# EAGLE design Backlight (EAGLE 7.2.0)
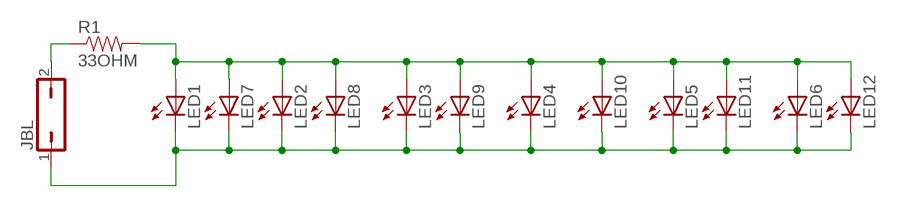
[diagram p0: schematic, sheet 1]

## Parts
JBL  JP1Q  [JP1]
LED1  LEDCHIP-LED0603  [CHIP-LED0603]
LED2  LEDCHIP-LED0603  [CHIP-LED0603]
LED3  LEDCHIP-LED0603  [CHIP-LED0603]
LED4  LEDCHIP-LED0603  [CHIP-LED0603]
LED5  LEDCHIP-LED0603  [CHIP-LED0603]
LED6  LEDCHIP-LED0603  [CHIP-LED0603]
LED7  LEDCHIP-LED0603  [CHIP-LED0603]
LED8  LEDCHIP-LED0603  [CHIP-LED0603]
LED9  LEDCHIP-LED0603  [CHIP-LED0603]
LED10  LEDCHIP-LED0603  [CHIP-LED0603]
LED11  LEDCHIP-LED0603  [CHIP-LED0603]
LED12  LEDCHIP-LED0603  [CHIP-LED0603]
R1  33OHM  33OHM1/10W1%(0603)  [0603]

## Nets
N$1: LED1.A LED2.A LED3.A LED4.A LED5.A LED6.A LED7.A LED8.A LED9.A LED10.A LED11.A LED12.A R1.2
N$2: JBL.1 LED1.C LED2.C LED3.C LED4.C LED5.C LED6.C LED7.C LED8.C LED9.C LED10.C LED11.C LED12.C
N$3: JBL.2 R1.1

## Library data of the parts
JBL = jumper:JP1Q: JUMPER
LED1-LED12 = adafruit:LED: LED OSRAM: - CHIPLED LG R971, LG N971, LY N971, LG Q971, LY Q971, LO R971, LY R971 LH N974, LH R974 LS Q976, LO Q976, LY Q976 LO Q996 - Hyper CHIPLED LW Q18S LB Q993, LB Q99A, LB R99A - SideLED LS A670, LO A670, LY A670, LG A670, LP A670 LB A673, LV A673, LT A673, LW A673 LH A674 LY A675 LS A676, LA A676, LO A676, LY A676, LW A676 LS A679, LY A679, LG A679 - Hyper Micro SIDELED® LS Y876, LA Y876, LO Y876, LY Y876 LT Y87S - SmartLED LW L88C, LW L88S LB L89C, LB L89S, LG L890 LS L89K, LO L89K, LY L89K LS L896, LA L896, LO L896, LY L896 - TOPLED LS T670, LO T670, LY T670, LG T670, LP T670 LSG T670, LSP T670, LSY T670, LOP T670, LYG T670 LG T671, LOG T671, LSG T671 LB T673, LV T673, LT T673, LW T673 LH T674 LS T676, LA T676, LO T676, LY T676, LB T676, LH T676, LSB T676, LW T676 LB T67C, LV T67C, LT T67C, LS T67K, LO T67K, LY T67K, LW E67C LS E67B, LA E67B, LO E67B, LY E67B, LB E67C, LV E67C, LT E67C LW T67C LS T679, LY T679, LG T679 LS T770, LO T770, LY T770, LG T770, LP T770 LB T773, LV T773, LT T773, LW T773 LH T774 LS E675, LA E675, LY E675, LS T675 LS T776, LA T776, LO T776, LY T776, LB T776 LHGB T686 LT T68C, LB T68C - Hyper Mini TOPLED® LB M676 - Mini TOPLED Santana® LG M470 LS M47K, LO M47K, LY M47K Source: http://www.osram.convergy.de/
R1 = SparkFun-Resistors:33OHM1/10W1%(0603): RES-08270; PROD_ID: RES-08270

## Board
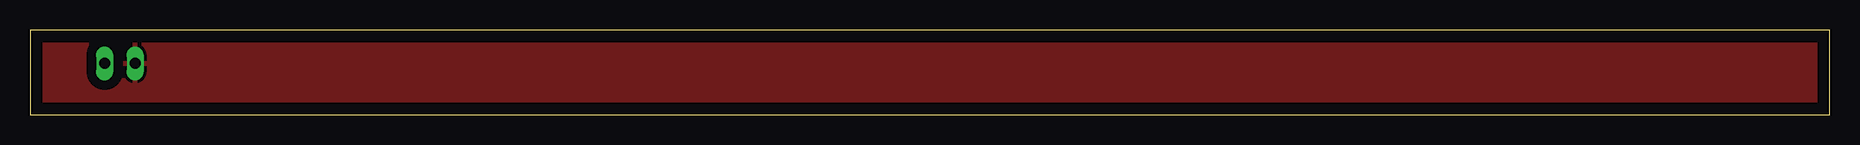
[diagram p1: board, top side]
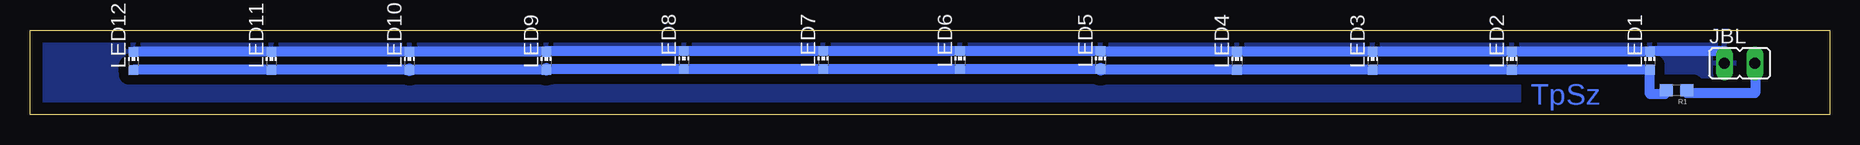
[diagram p2: board, bottom side, seen from below]

Size 150 x 7.05 mm. Coordinates in mm from the lower left corner, seen from the top.
Outline: 0,0 150,0 150,7.05 0,7.05 0,0
Copper layers (1*16): Top 0.035mm / dielectric 1.5mm / Bottom 0.035mm
Design rules "default": minimum track width 10mil, minimum drill 24mil, track to track 8mil, track to pad 8mil, pad to pad 8mil, via to via 8mil, smd to smd 8mil, copper to edge 40mil, drill to drill 8mil, minimum pad ring 10mil, minimum via ring 8mil, stop-mask expansion 4mil, vias tented up to drill 0mil, thermal gap 10mil

### Footprints (pad centres in the part's own frame; a part is rotated, then mirrored left to right if it is on the bottom)
JP1 = drill 0.914 long: 1 0,-1.27; 2 0,1.27
CHIP-LED0603 = smd 0.8 x 0.8: A 0,-0.75; C 0,0.75
0603 = smd 1.1 x 1: 1 -0.85,0; 2 0.85,0

### Placement (x,y rotation side)
JBL  7.49,4.27 270 bottom
LED1  14.97,4.49 0 bottom
LED2  26.48,4.49 0 bottom
LED3  38.09,4.49 0 bottom
LED4  49.4,4.49 0 bottom
LED5  60.77,4.54 0 bottom
LED6  72.48,4.54 0 bottom
LED7  83.89,4.54 0 bottom
LED8  95.5,4.54 0 bottom
LED9  106.97,4.49 0 bottom
LED10  118.37,4.47 0 bottom
LED11  129.89,4.47 0 bottom
LED12  141.38,4.47 0 bottom
R1  12.75,2.01 180 bottom

### Tracks (layer width: path | path; a pad name or v marks a point on that pad's centre or on a via)
N$1
  Bottom 0.813: 60.77,3.74 LED4.A LED3.A LED2.A LED1.A 14.97,1.7 13.7,1.7 13.7,1.81 R1.2 | LED5.A LED6.A LED7.A LED8.A 106.97,3.79 | LED9.A 118.37,3.74 | LED10.A LED11.A LED12.A
  Bottom 1.016: 60.77,3.74 LED5.A | 106.97,3.79 LED9.A | 118.37,3.74 LED10.A
N$2
  Bottom 0.813: LED12.C LED11.C LED10.C 118.37,5.24 LED9.C 106.97,5.29 LED8.C LED7.C LED6.C LED5.C 60.77,5.24 LED4.C LED3.C LED2.C LED1.C 14.97,5.3 8.7,5.3 8.7,3.87 JBL.1
  pour Top (isolate 0.813): 0.1,6.9 149.8,6.9 149.8,0.1 0.1,0.1
  pour Bottom (isolate 0.813): 0.1,6.9 149.9,6.9 149.9,0.1 0.1,0.1
N$3
  Bottom 0.813: JBL.2 6.2,3.87 6.2,1.8 11.9,1.8 R1.1

### Text on the board
Bottom: TpSz